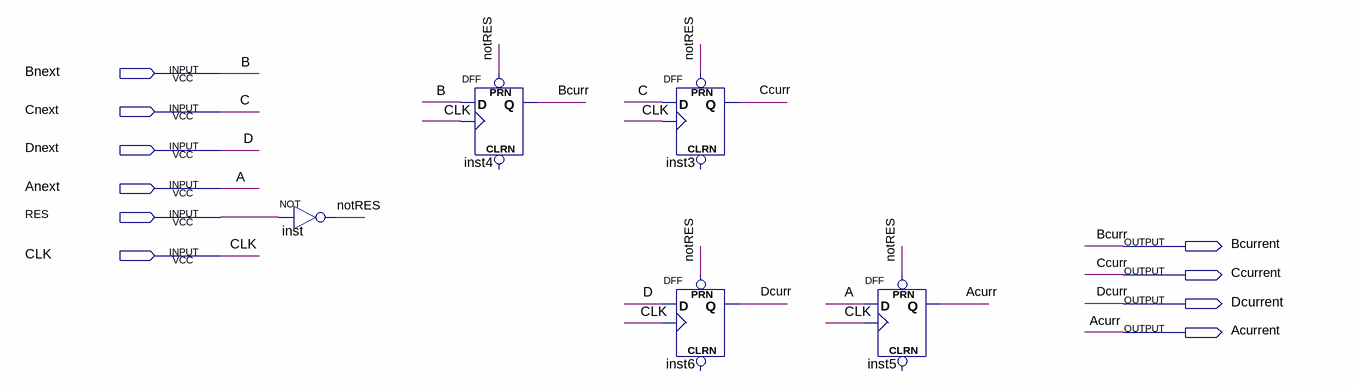
[diagram p0: schematic sheet]
// Quartus schematic regs.bdf as structural Verilog: 5 symbols, 10 pins
module regs (
  input  Bnext,
  input  Cnext,
  input  Dnext,
  input  Anext,
  input  RES,
  input  CLK,
  output Bcurrent,
  output Ccurrent,
  output Dcurrent,
  output Acurrent
);

  wire notRES;

  not inst (notRES, RES);
  DFF inst4 (.CLK(CLK), .D(Bnext), .PRN(notRES), .Q(Bcurrent));  // open: CLRN
  DFF inst3 (.CLK(CLK), .D(Cnext), .PRN(notRES), .Q(Ccurrent));  // open: CLRN
  DFF inst6 (.CLK(CLK), .D(Dnext), .PRN(notRES), .Q(Dcurrent));  // open: CLRN
  DFF inst5 (.CLK(CLK), .D(Anext), .PRN(notRES), .Q(Acurrent));  // open: CLRN

  // Other names for the same wires on the sheet: A = Anext; Acurr = Acurrent; B = Bnext; Bcurr = Bcurrent; C = Cnext;
  //   Ccurr = Ccurrent; D = Dnext; Dcurr = Dcurrent
endmodule
